# EAGLE design under_construction_v1 (EAGLE 8.7.1)
DATABASE: ./dk_bom.db
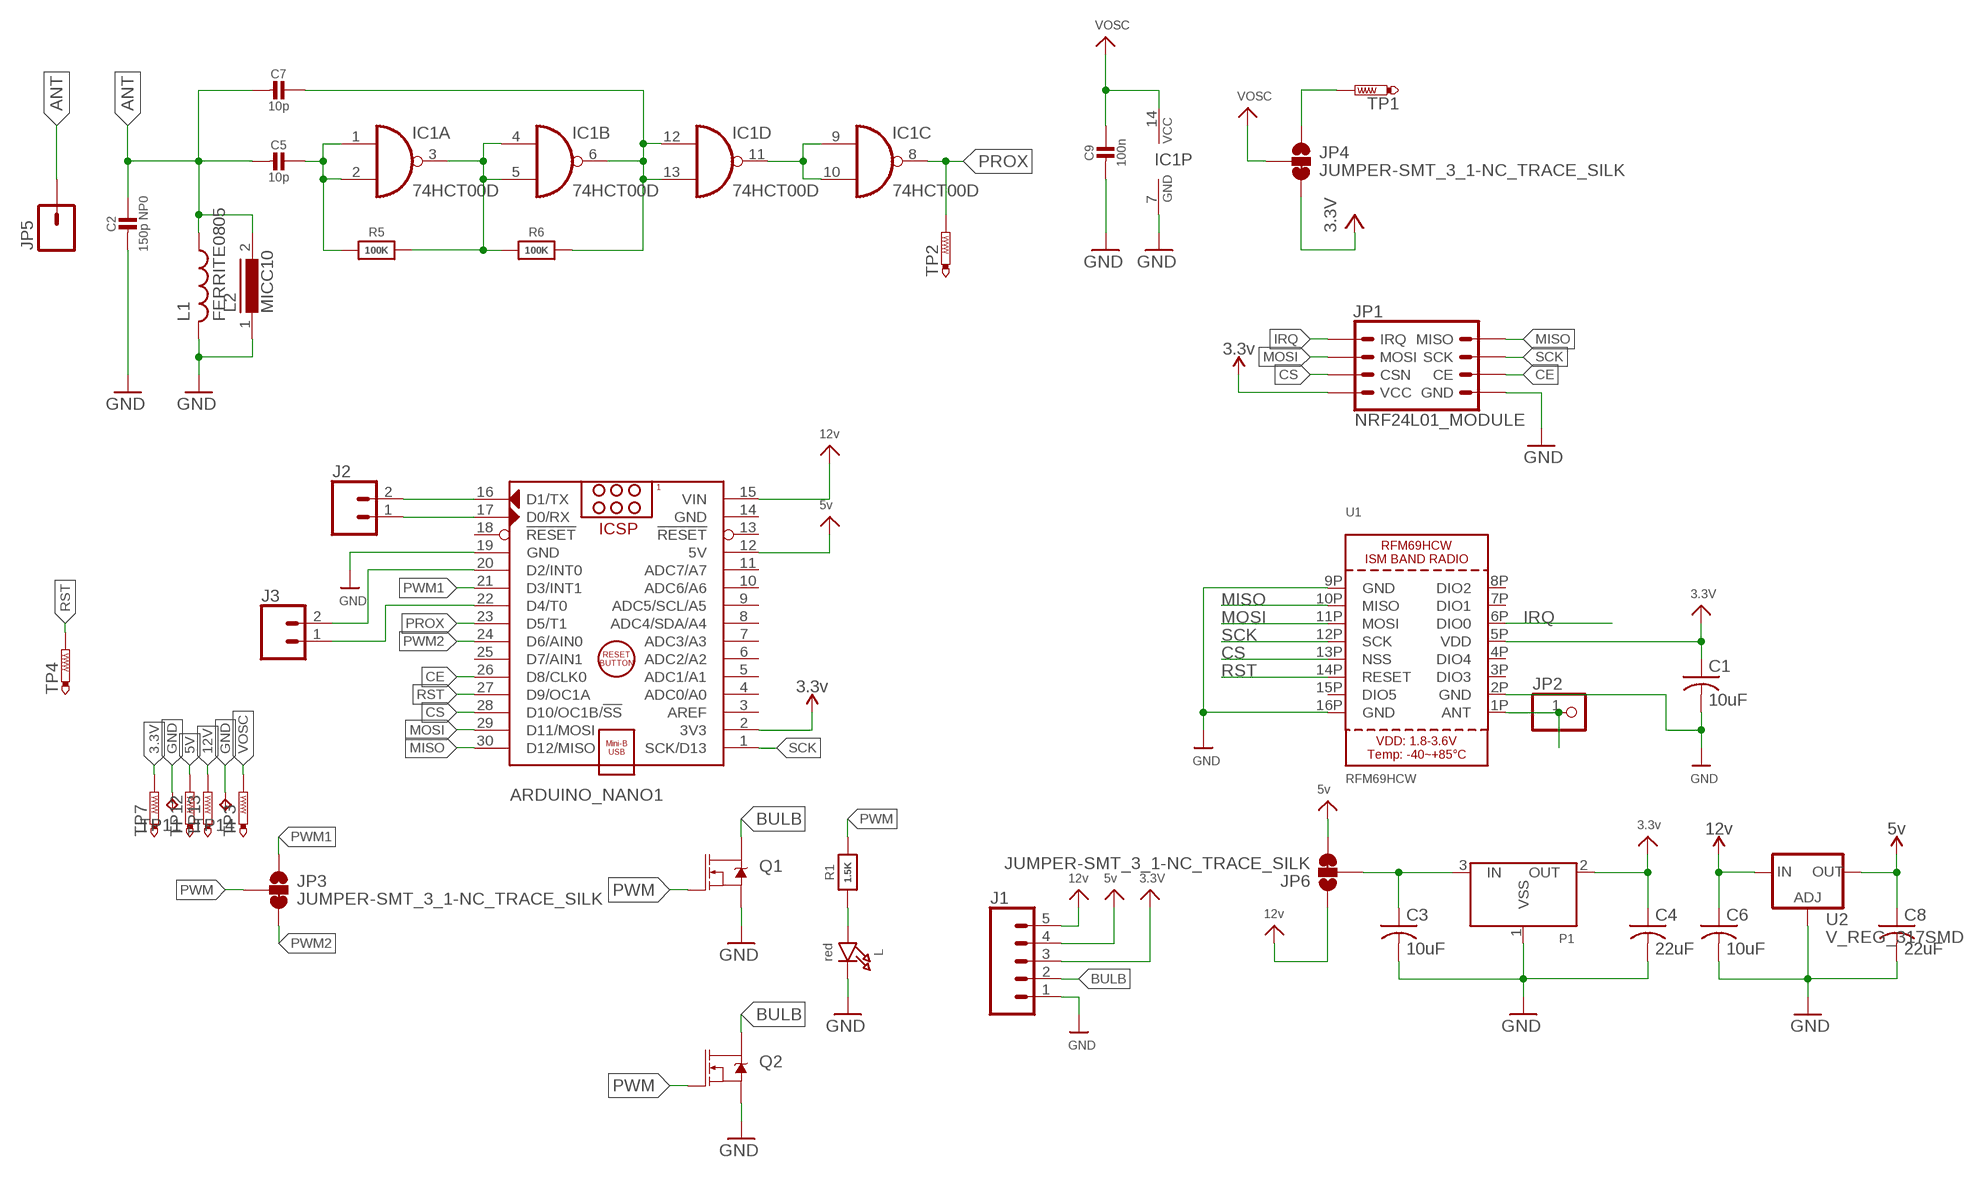
[diagram p0: schematic, sheet 1]

## Parts
ARDUINO_NANO1  ARDUINO_NANO  [ARDUINO_NANO]
C1  10uF  C-USC0805  [C0805]
C2  150p NP0  CAP_CERAMIC0805-NOOUTLINE  [0805-NO]
C3  10uF  C-USC0805  [C0805]
C4  22uF  C-USC0805  [C0805]
C5  10p  CAP_CERAMIC0805-NOOUTLINE  [0805-NO]
C6  10uF  C-USC0805  [C0805]
C7  10p  CAP_CERAMIC0805-NOOUTLINE  [0805-NO]
C8  22uF  C-USC0805  [C0805]
C9  100n  CAP_CERAMIC0805-NOOUTLINE  [0805-NO]
IC1  74HCT00D  [SO14]
J1  CONN_05PTH_LONGPADS  [1X05_LONGPADS]
J2  CONN_02PTH3  [1X02_LONGPADS]
J3  CONN_02PTH3  [1X02_LONGPADS]
JP1  NRF24L01_MODULE  [2X4]
JP2  HEADER-1X1ROUND  [1X01_ROUND]
JP3  JUMPER-SMT_3_1-NC_TRACE_SILK  [SMT-JUMPER_3_1-NC_TRACE_SILK]
JP4  JUMPER-SMT_3_1-NC_TRACE_SILK  [SMT-JUMPER_3_1-NC_TRACE_SILK]
JP5  M01PTH  [1X01]
JP6  JUMPER-SMT_3_1-NC_TRACE_SILK  [SMT-JUMPER_3_1-NC_TRACE_SILK]
L  red  LED0603_NOOUTLINE  [CHIPLED_0603_NOOUTLINE]
L1  FERRITE0805  [0805]
L2  MICC10  [MICC10]
P1  XC6206SOT-89  [SOT-89]
Q1  MOSFET-NCH-FQP30N06L  [TO220V]
Q2  MOSFET-NCH-FQP30N06L  [TO220V]
R1  1.5K  RESISTOR_0603_NOOUT  [0603-NO]
R5  100K  RESISTOR0805_NOOUTLINE  [0805-NO]
R6  100K  RESISTOR0805_NOOUTLINE  [0805-NO]
TP1  VOSC  PTR1TP15R  [TP15R]
TP2  PROX  PTR1TP15R  [TP15R]
TP3  VOSC  PTR1TP15R  [TP15R]
TP4  VOSC  PTR1TP15R  [TP15R]
TP7  VOSC  PTR1TP15R  [TP15R]
TP11  VOSC  TPTP15SQ  [TP15SQ]
TP12  VOSC  PTR1TP15R  [TP15R]
TP13  VOSC  PTR1TP15R  [TP15R]
TP14  VOSC  TPTP15SQ  [TP15SQ]
U1  RFM69HCW  RFM69HCW_SMT  [RFMHCW_SMT]
U2  V_REG_317SMD  [SOT223]

## Nets
3.3V: ARDUINO_NANO1.2(3V3) C1.1 C4.1 J1.3 JP1.7(VCC) JP4.3 P1.2(OUT) TP7.TP U1.5P(VDD) ; supply symbol labelled 3.3v
5V: ARDUINO_NANO1.12(5V) C8.1 J1.4 JP6.3 TP12.TP U2.2(OUT) ; supply symbol labelled 5v
12V: ARDUINO_NANO1.15(VIN) C6.1 J1.5 JP6.1 TP13.TP U2.3(IN) ; supply symbol labelled 12v
ANT: C2.1 C5.2 C7.2 JP5.1 L1.1 L2.2
BULB: J1.2 Q1.2(D) Q2.2(D)
CE: ARDUINO_NANO1.26(D8/CLK0) JP1.6(CE)
CS: ARDUINO_NANO1.28(D10/OC1B/!SS) JP1.5(CSN) U1.13P(NSS)
GND: ARDUINO_NANO1.19(GND) C1.2 C2.2 C3.2 C4.2 C6.2 C8.2 C9.2 IC1.7(P:GND) J1.1 JP1.8(GND) L1.2 L2.1 L.C P1.1(VSS) Q1.3(S) Q2.3(S) TP11.TP TP14.TP U1.2P(GND) U1.9P(GND) U1.16P(GND) U2.1(ADJ)
IRQ: JP1.1(IRQ) U1.6P(DIO0)
MISO: ARDUINO_NANO1.30(D12/MISO) JP1.2(MISO) U1.10P(MISO)
MOSI: ARDUINO_NANO1.29(D11/MOSI) JP1.3(MOSI) U1.11P(MOSI)
N$1: JP2.1 U1.1P(ANT)
N$2: C5.1 IC1.1(A:I0) IC1.2(A:I1) R5.1
N$3: IC1.3(A:O) IC1.4(B:I0) IC1.5(B:I1) R5.2 R6.1
N$4: C7.1 IC1.6(B:O) IC1.12(D:I0) IC1.13(D:I1) R6.2
N$5: C3.1 JP6.2 P1.3(IN)
N$6: ARDUINO_NANO1.17(D0/RX) J2.1
N$7: IC1.9(C:I0) IC1.10(C:I1) IC1.11(D:O)
N$8: ARDUINO_NANO1.16(D1/TX) J2.2
N$9: ARDUINO_NANO1.20(D2/INT0) J3.2
N$10: JP4.1 TP1.TP
N$11: ARDUINO_NANO1.22(D4/T0) J3.1
N$12: L.A R1.1
PROX: ARDUINO_NANO1.23(D5/T1) IC1.8(C:O) TP2.TP
PWM: JP3.2 Q1.1(G) Q2.1(G) R1.2
PWM1: ARDUINO_NANO1.21(D3/INT1) JP3.1
PWM2: ARDUINO_NANO1.24(D6/AIN0) JP3.3
RST: ARDUINO_NANO1.27(D9/OC1A) TP4.TP U1.14P(RESET)
SCK: ARDUINO_NANO1.1(SCK/D13) JP1.4(SCK) U1.12P(SCK)
VOSC: C9.1 IC1.14(P:VCC) JP4.2 TP3.TP
Unconnected: ARDUINO_NANO1.3(AREF) ARDUINO_NANO1.4(ADC0/A0) ARDUINO_NANO1.5(ADC1/A1) ARDUINO_NANO1.6(ADC2/A2) ARDUINO_NANO1.7(ADC3/A3) ARDUINO_NANO1.8(ADC4/SDA/A4) ARDUINO_NANO1.9(ADC5/SCL/A5) ARDUINO_NANO1.10(ADC6/A6) ARDUINO_NANO1.11(ADC7/A7) ARDUINO_NANO1.13(!RESET) ARDUINO_NANO1.18(!RESET) ARDUINO_NANO1.25(D7/AIN1) U1.3P(DIO3) U1.4P(DIO4) U1.7P(DIO1) U1.8P(DIO2) U1.15P(DIO5)

## Power pins joined to a net without a drawn wire
GND: ARDUINO_NANO1.14(GND)

## Library data of the parts
ARDUINO_NANO1 = ArduinoNanoV30:ARDUINO_NANO: Arduino Nano V3.0 Module Overview: The Arduino Nano is a small, complete, and breadboard-friendly board based on the ATmega328 (Arduino Nano 3.x) or ATmega168 (Arduino Nano 2.x). It has more or less the same functionality of the Arduino Duemilanove, but in a different package. It lacks only a DC power jack, and works with a Mini-B USB cable instead of a standard one. The Nano was designed and is being produced by Gravitech <http://www.gravitech.us/arna30wiatp.html>. General specifications: Item Value Microcontroller Atmel ATmega168 or ATmega328 Operating Voltage (logic level) 5 V Input Voltage (recommended) 7-12 V Input Voltage (limits) 6-20 V Digital I/O Pins 14 (of which 6 provide PWM output) Analog Input Pins 8 DC Current per I/O Pin 40 mA Flash Memory 16 KB (ATmega168) or 32 KB (ATmega328) of which 2 KB used by bootloader SRAM 1 KB (ATmega168) or 2 KB (ATmega328) EEPROM 512 bytes (ATmega168) or 1 KB (ATmega328) Clock Speed 16 MHz Dimensions (Inches) 0.73" x 1.70" Dimensions (mm) 18mm x 45mm Overall height About 9 mm (not including pins) Weigth 5 g Power: The Arduino Nano can be powered via the Mini-B USB connection, 6-20V unregulated external power supply (pin 30), or 5V regulated external power supply (pin 27). The power source is automatically selected to the highest voltage source. Memory: The ATmega168 has 16 KB of flash memory for storing code (of which 2 KB is used for the bootloader); the ATmega328 has 32 KB, (also with 2 KB used for the bootloader). The ATmega168 has 1 KB of SRAM and 512 bytes of EEPROM (which can be read and written with the EEPROM library); the ATmega328 has 2 KB of SRAM and 1 KB of EEPROM. Input and Output: Each of the 14 digital pins on the Nano can be used as an input or output, using pinMode(), digitalWrite(), and digitalRead() functions. They operate at 5 volts. Each pin can provide or receive a maximum of 40 mA and has an internal pull-up resistor (disconnected by default) of 20-50 kOhms. In addition, some pins have specialized functions. Visit Arduino - ArduinoBoardNano <https://www.arduino.cc/en/Main/ArduinoBoardNano>
C1 = adafruit:C-US: CAPACITOR, American symbol; PARTNO: EMK212ABJ106MG-T
C2 = microbuilder:CAP_CERAMIC: Ceramic Capacitors For new designs, use the packages preceded by an '_' character since they are more reliable: The following footprints should be used on most boards: _0402 - Standard footprint for regular board layouts _0603 - Standard footprint for regular board layouts _0805 - Standard footprint for regular board layouts _1206 - Standard footprint for regular board layouts For extremely tight-pitch boards where space is at a premium, the following 'micro-pitch' footprints can be used (smaller pads, no silkscreen outline, etc.): _0402MP - Micro-pitch footprint for very dense/compact boards _0603MP - Micro-pitch footprint for very dense/compact boards _0805MP - Micro-pitch footprint for very dense/compact boards _1206MP - Micro-pitch footprint for very dense/compact boards; PARTNO: C0805C151J5GACTU
C3 C6 = adafruit:C-US: CAPACITOR, American symbol; PARTNO: LMK212AB7106MG-T
C4 C8 = adafruit:C-US: CAPACITOR, American symbol; PARTNO: CL21A226MQQNNNE
C5 C7 = microbuilder:CAP_CERAMIC: Ceramic Capacitors For new designs, use the packages preceded by an '_' character since they are more reliable: The following footprints should be used on most boards: _0402 - Standard footprint for regular board layouts _0603 - Standard footprint for regular board layouts _0805 - Standard footprint for regular board layouts _1206 - Standard footprint for regular board layouts For extremely tight-pitch boards where space is at a premium, the following 'micro-pitch' footprints can be used (smaller pads, no silkscreen outline, etc.): _0402MP - Micro-pitch footprint for very dense/compact boards _0603MP - Micro-pitch footprint for very dense/compact boards _0805MP - Micro-pitch footprint for very dense/compact boards _1206MP - Micro-pitch footprint for very dense/compact boards; PARTNO: CL21C100DBANNNC
C9 = microbuilder:CAP_CERAMIC: Ceramic Capacitors For new designs, use the packages preceded by an '_' character since they are more reliable: The following footprints should be used on most boards: _0402 - Standard footprint for regular board layouts _0603 - Standard footprint for regular board layouts _0805 - Standard footprint for regular board layouts _1206 - Standard footprint for regular board layouts For extremely tight-pitch boards where space is at a premium, the following 'micro-pitch' footprints can be used (smaller pads, no silkscreen outline, etc.): _0402MP - Micro-pitch footprint for very dense/compact boards _0603MP - Micro-pitch footprint for very dense/compact boards _0805MP - Micro-pitch footprint for very dense/compact boards _1206MP - Micro-pitch footprint for very dense/compact boards; PARTNO: 885012207072
IC1 = 74xx-eu:74*00: Quad 2-input NAND gate; PARTNO: SN74HC00NSR
J1 = SparkFun-Connectors:CONN_05: Multi connection point. Often used as Generic Header-pin footprint for 0.1 inch spaced/style header connections On any of the 0.1 inch spaced packages, you can populate with these: Break Away Headers - Straight <https://www.sparkfun.com/products/116> (PRT-00116) Break Away Male Headers - Right Angle <https://www.sparkfun.com/products/553> (PRT-00553) Female Headers <https://www.sparkfun.com/products/115> (PRT-00115) Break Away Headers - Machine Pin <https://www.sparkfun.com/products/117> (PRT-00117) Break Away Female Headers - Swiss Machine Pin <https://www.sparkfun.com/products/743> (PRT-00743) For SCREWTERMINALS and SPRING TERMINALS visit here: Screw Terimnals on SparkFun.com <https://www.sparkfun.com/search/results?term=Screw+Terminals> (5mm/3.5mm/2.54mm spacing) This device is also useful as a general connection point to wire up your design to another part of your project. Our various solder wires solder well into these plated through hole pads. Hook-Up Wire - Assortment (Stranded, 22 AWG) <https://www.sparkfun.com/products/11375> (PRT-11375) Hook-Up Wire - Assortment (Solid Core, 22 AWG) <https://www.sparkfun.com/products/11367> (PRT-11367) View the entire wire category on our website here <https://www.sparkfun.com/categories/141> Special notes: Molex polarized connector foot print use with SKU : PRT-08231 with associated crimp pins and housings. 1MM SMD Version SKU: PRT-10208
J2 J3 = SparkFun-Connectors:CONN_02: Multi connection point. Often used as Generic Header-pin footprint for 0.1 inch spaced/style header connections On any of the 0.1 inch spaced packages, you can populate with these: Break Away Headers - Straight <https://www.sparkfun.com/products/116> (PRT-00116) Break Away Male Headers - Right Angle <https://www.sparkfun.com/products/553> (PRT-00553) Female Headers <https://www.sparkfun.com/products/115> (PRT-00115) Break Away Headers - Machine Pin <https://www.sparkfun.com/products/117> (PRT-00117) Break Away Female Headers - Swiss Machine Pin <https://www.sparkfun.com/products/743> (PRT-00743) For SCREWTERMINALS and SPRING TERMINALS visit here: Screw Terimnals on SparkFun.com <https://www.sparkfun.com/search/results?term=Screw+Terminals> (5mm/3.5mm/2.54mm spacing) This device is also useful as a general connection point to wire up your design to another part of your project. Our various solder wires solder well into these plated through hole pads. Hook-Up Wire - Assortment (Stranded, 22 AWG) <https://www.sparkfun.com/products/11375> (PRT-11375) Hook-Up Wire - Assortment (Solid Core, 22 AWG) <https://www.sparkfun.com/products/11367> (PRT-11367) View the entire wire category on our website here <https://www.sparkfun.com/categories/141> Special notes: Molex polarized connector foot print use with: PRT-08233 with associated crimp pins and housings. 2.54_SCREWTERM for use with PRT-10571. 3.5mm Screw Terminal footprints for PRT-08084 5mm Screw Terminal footprints for use with PRT-08432
JP1 = under_construction:NRF24L01_MODULE
JP2 = microbuilder:HEADER-1X1: PIN HEADER
JP3 JP4 JP6 = SparkFun-Jumpers:JUMPER-SMT_3_1-NC_TRACE: Normally closed trace jumper (1 of 2 connections) This jumper has a trace between two pads so it's normally closed (NC). The other connection is normally open (NO). Use a razor knife to open the connection. For best results follow the IPC guidelines for cutting traces: Cutout at least 0.063 mm (0.005 in). Remove all loose material to clean up the cut area. Seal the cut with an approved epoxy. Reapply solder to reclose the connection, or to close the NO connection.
JP5 = RFM69HCW_BOB:M01: Header 1 Standard 1-pin 0.1" header. Use with straight break away headers (SKU : PRT-00116), right angle break away headers (PRT-00553), swiss pins (PRT-00743), machine pins (PRT-00117), and female headers (PRT-00115).
L = microbuilder:LED: LED 0603 - 0603 Surface Mount Package 2mA: Green LED - Low Power (3.9mcd, 2ma, 1.7Vf) - Digikey: 475-2709-2-ND Orange LED - Low Power (9.8mcd, 2ma, 1.8Vf) - Digikey: 475-1194-2-ND Red LED - Low Power (5mcd, 2ma, 1.8Vf) - Digikey: 475-1195-2-ND Yellow LED - Low Power (7mcd, 2ma, 1.8Vf) - Digikey: 475-1196-2-ND 5mA: Blue LED - Low Power (17mcd, 5ma, 2.9Vf) - Digikey: LNJ937W8CRACT-ND 0805 - 0805 Surface Mount Package 2mA: Red LED (8.8mcd, 2mA, 1.8Vf, Clear) - Low Power [Digikey: 475-2510-1-ND] Green LED (5mcd, 2mA, 1.8Vf, Clear) - Low Power [Digikey: 475-2730-1-ND] Yellow LED (11.3mcd, 2mA, 1.8Vf, Clear) - Low Power [Digikey: 475-2555-1-ND] 20mA: Red LED (104mcd, 20mA, Diffused) - LS R976 [Digikey: 475-1278-6-ND] Red LED (12mcd, 20mA, 2.0Vf, Clear) - APT2012EC [Digikey: 754-1128-1-ND] Green LED (15mcd, 20mA, 2.2Vf, Clear) - APT2012GC [Digikey: 754-1131-1-ND] Orange LED (160mcd, 20mA, 2.1Vf, Clear) - APT2012SECK [Digikey: 754-1130-1-ND] 1206 - 1206 Surface Mount Package Green LED (26mcd, 20mA, Diffused) - LG N971 [Digikey: 475-1407-6-ND] Red LED (15mcd, 20mA, Diffused) - LH N974 [Digikey: 475-1416-6-ND] Cree - Cree High-Power Surface Mount LEDs XPEBWT-L1-0000-00D50 - White 111lm 350mA 2.9Vf 6200K 110° XTEAWT-00-0000-00000LEE3 - White 114lm 350mA 2.85Vf 5000K 115° Everlight - Everlight 45-21 Series Surface Mount LEDs 45-21/QK2C-B2832AC2CB2/2T - Warm White 2000mcd 20mA 3.25Vf 3050K 120° 45-21/LK2C-B38452C4CB2/2T - Nuetral White 2000mcd 20mA 3.25Vf 4150K 120° 45-21/LK2C-B50634C6CB2/2T - Cold White 2200mcd 20mA 3.25Vf 5650K 120° PLCC2 Reverse Mount LS T77K-J1L2-1-0-2-R18-Z - Red 11.25mcd 2mA 1.8Vf 630nm 120° LO T77K-L1M2-24-Z - Orange 19.6mcd 2mA 1.8Vf 606nm 120° LY T77K-K2M1-26-Z - Yellow 15.7mcd 2mA 1.8Vf 587nm 120°; PARTNO: 150080SS75000
L1 = Livestream:FERRITE; PARTNO: MLZ2012N100LT000
L2 = inductors:MICC10: INDUCTOR; PARTNO: B78108T1103K000; SPICEPREFIX: L
P1 = Voltage Regulator:XC6206: XC6206P , linear regulator. Producted by TOREX.Co Store Information: EXCEL device corporation http://www.excel-d.com/access/index.html; PARTNO: AZ1117CR-3.3TRG1
Q1 Q2 = SparkFun-DiscreteSemi:MOSFET-NCH: N-channel MOSFETs Voltage controlled devices that allow control of high current outputs. SparkFun Products: SparkFun OpenScale <https://www.sparkfun.com/products/13261> SparkFun Digital Sandbox <https://www.sparkfun.com/products/12651> SparkFun Monster Moto Shield <https://www.sparkfun.com/products/10182> SparkFun MOSFET Power Controller <https://www.sparkfun.com/products/11214>; PARTNO: IRF3708PBF; PROD_ID: TRANS-10060; VALUE: 60V/32A/35mΩ
R1 = microbuilder:RESISTOR: Resistors For new designs, use the packages preceded by an '_' character since they are more reliable: The following footprints should be used on most boards: _0402 - Standard footprint for regular board layouts _0603 - Standard footprint for regular board layouts _0805 - Standard footprint for regular board layouts _1206 - Standard footprint for regular board layouts For extremely tight-pitch boards where space is at a premium, the following 'micro-pitch' footprints can be used (smaller pads, no silkscreen outline, etc.): _0402MP - Micro-pitch footprint for very dense/compact boards _0603MP - Micro-pitch footprint for very dense/compact boards _0805MP - Micro-pitch footprint for very dense/compact boards _1206MP - Micro-pitch footprint for very dense/compact boards; PARTNO: RNCP0603FTD1K50
R5 R6 = microbuilder:RESISTOR: Resistors For new designs, use the packages preceded by an '_' character since they are more reliable: The following footprints should be used on most boards: _0402 - Standard footprint for regular board layouts _0603 - Standard footprint for regular board layouts _0805 - Standard footprint for regular board layouts _1206 - Standard footprint for regular board layouts For extremely tight-pitch boards where space is at a premium, the following 'micro-pitch' footprints can be used (smaller pads, no silkscreen outline, etc.): _0402MP - Micro-pitch footprint for very dense/compact boards _0603MP - Micro-pitch footprint for very dense/compact boards _0805MP - Micro-pitch footprint for very dense/compact boards _1206MP - Micro-pitch footprint for very dense/compact boards; PARTNO: RC2012J104CS
TP1-TP4 TP7 TP12 TP13 = tenna_avr_AD7021_v0_9_shrink:PTR1: TEST PIN .063mm, 25mil circular test point
TP11 TP14 = testpad:TP: Test pad
U1 = microbuilder:RFM69HCW: RFM69HCW - ISM Band RF Transceiver
U2 = SparkFun-IC-Power:V_REG_317: Voltage Regulator Standard LM317 adjustable voltage regulator. AOI (Adjust Output Input). Google 'LM317 Calculator' for easy to use app to get the two resistor values needed. 240/720 for 5V output. 240/390 for 3.3V output. Spark Fun Electronics SKU : COM-00527; PARTNO: AZ1117IH-5.0TRG1

## Board
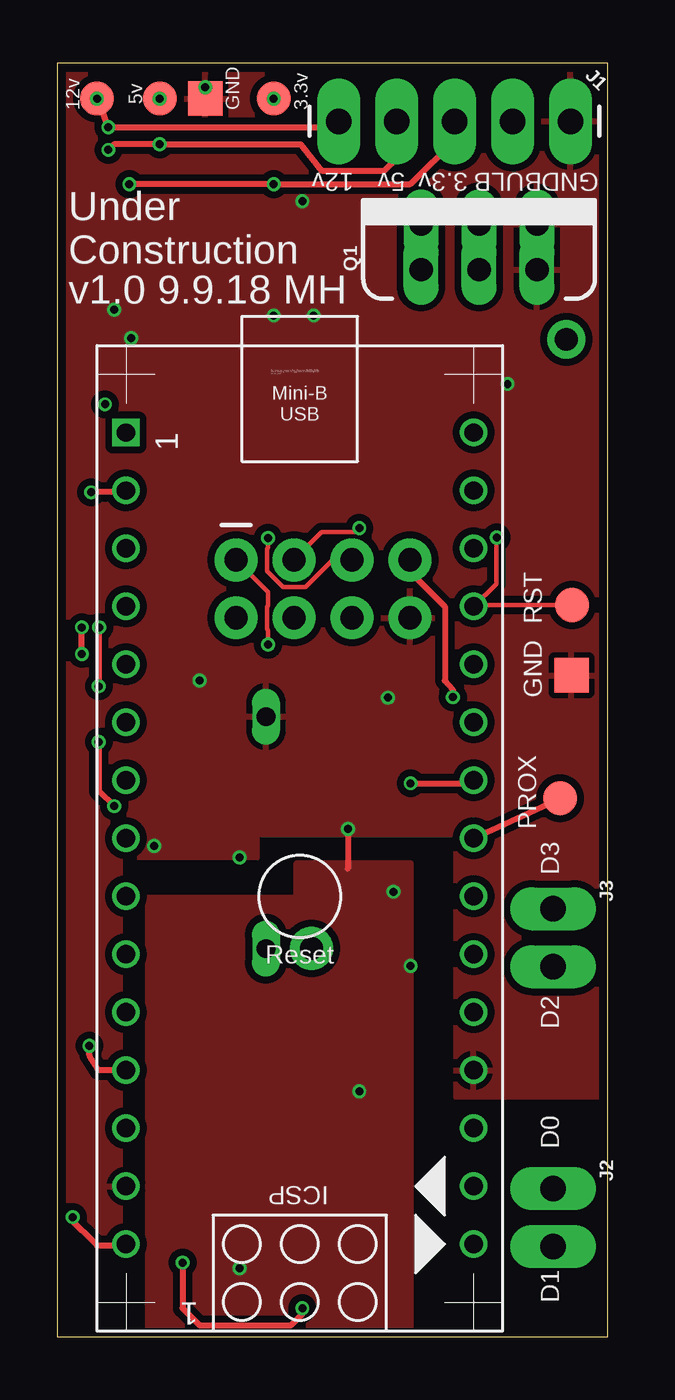
[diagram p1: board, top side]
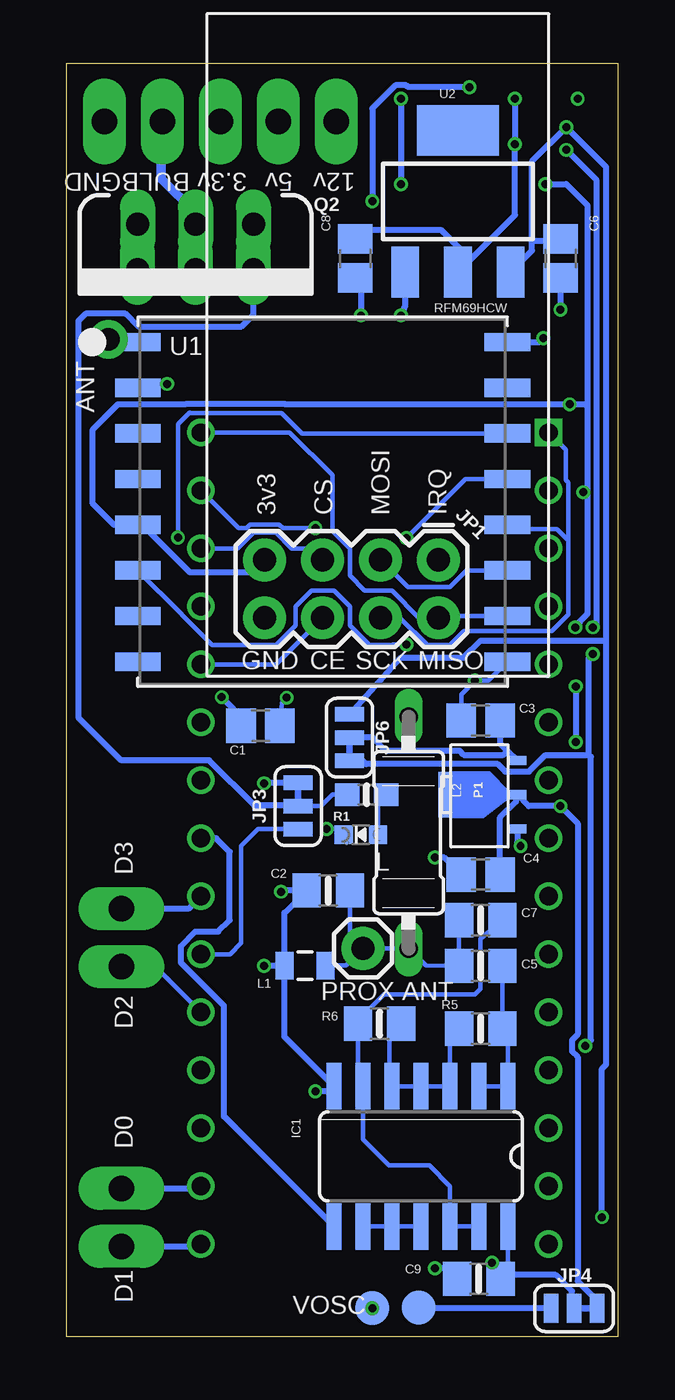
[diagram p2: board, bottom side, seen from below]

Size 24.15 x 55.8 mm. Coordinates in mm from the lower left corner, seen from the top.
Outline: 0,0 24.15,0 24.15,55.8 0,55.8 0,0
Copper layers (1*16): Top 0.035559375mm / dielectric 1.6mm / Bottom 0.035559375mm
Design rules "oshpark_2layer": minimum track width 6mil, minimum drill 10mil, track to track 6mil, track to pad 6mil, pad to pad 6mil, via to via 6mil, smd to smd 6mil, copper to edge 15mil, drill to drill 6mil, minimum pad ring 5mil, minimum via ring 5mil, stop-mask expansion 2.5mil, vias tented up to drill 0mil, thermal gap 10mil

### Footprints (pad centres in the part's own frame; a part is rotated, then mirrored left to right if it is on the bottom)
ARDUINO_NANO = drill 0.8 square: 1 -20.32,-7.62 | drill 0.8: 2 -17.78,-7.62; 3 -15.24,-7.62; 4 -12.7,-7.62; 5 -10.16,-7.62; 6 -7.62,-7.62; 7 -5.08,-7.62; 8 -2.54,-7.62; 9 0,-7.62; 10 2.54,-7.62; 11 5.08,-7.62; 12 7.62,-7.62; 13 10.16,-7.62; 14 12.7,-7.62; 15 15.24,-7.62; 16 15.24,7.62; 17 12.7,7.62; 18 10.16,7.62; 19 7.62,7.62; 20 5.08,7.62; 21 2.54,7.62; 22 0,7.62; 23 -2.54,7.62; 24 -5.08,7.62; 25 -7.62,7.62; 26 -10.16,7.62; 27 -12.7,7.62; 28 -15.24,7.62; 29 -17.78,7.62; 30 -20.32,7.62
C0805 = smd 1.3 x 1.5: 1 -0.85,0; 2 0.85,0
0805-NO = smd 1.24 x 1.5: 1 -0.95,0; 2 0.95,0
SO14 = smd 0.66 x 2.032: 1 -3.81,-3.073; 2 -2.54,-3.073; 3 -1.27,-3.073; 4 0,-3.073; 5 1.27,-3.073; 6 2.54,-3.073; 7 3.81,-3.073; 8 3.81,3.073; 9 2.54,3.073; 10 1.27,3.073; 11 0,3.073; 12 -1.27,3.073; 13 -2.54,3.073; 14 -3.81,3.073
1X05_LONGPADS = drill 1.118 pad 1.88 long: 1 0,0; 2 2.54,0; 3 5.08,0; 4 7.62,0; 5 10.16,0
1X02_LONGPADS = drill 1.118 pad 1.88 long: 1 0,0; 2 2.54,0
2X4 = drill 1.016 pad 1.88: 1 -3.81,-1.27; 2 -3.81,1.27; 3 -1.27,-1.27; 4 -1.27,1.27; 5 1.27,-1.27; 6 1.27,1.27; 7 3.81,-1.27; 8 3.81,1.27
1X01_ROUND = drill 1 pad 1.676: 1 0,0
SMT-JUMPER_3_1-NC_TRACE_SILK = smd 0.635 x 1.27: 1 -1.016,0; 2 0,0; 3 1.016,0
1X01 = drill 1.016 pad 1.88: 1 0,0
CHIPLED_0603_NOOUTLINE = smd 0.8 x 0.8: A 0,-0.75; C 0,0.75
0805 = smd 0.8 x 1.2: 1 -0.9,0; 2 0.9,0
MICC10 = drill 0.813 long: 1 -5.08,0; 2 5.08,0
SOT-89 = smd 0.406 x 0.813: 1 -1.5,-1.6; 2 0,-1.6; 3 1.5,-1.6 | smd 2 x 0.5: P$4 0,1.6
TO220V = drill 1.016 long: 1 -2.54,0; 2 0,0; 3 2.54,0
0603-NO = smd 1.075 x 1: 1 -0.85,0; 2 0.85,0
TP15R = smd 1.5 x 1.5: TP 0,0
TP15SQ = smd 1.5 x 1.5: TP 0,0
RFMHCW_SMT = smd 2 x 0.8: 1P 8.1,-7; 2P 8.1,-5; 3P 8.1,-3; 4P 8.1,-1; 5P 8.1,1; 6P 8.1,3; 7P 8.1,5; 8P 8.1,7; 9P -8.1,7; 10P -8.1,5; 11P -8.1,3; 12P -8.1,1; 13P -8.1,-1; 14P -8.1,-3; 15P -8.1,-5; 16P -8.1,-7
SOT223 = smd 1.219 x 2.235: 1 -2.311,-3.099; 2 0,-3.099; 3 2.311,-3.099 | smd 3.6 x 2.2: 4 0,3.099

### Placement (x,y rotation side)
ARDUINO_NANO1  10.64,19.3 270 top
C1  15.65,26.77 0 bottom
C2  12.68,19.55 180 bottom
C3  6,27 180 bottom
C4  6,20.25 180 bottom
C5  6,16.25 180 bottom
C6  2.5,47.25 270 bottom
C7  6,18.25 180 bottom
C8  11.5,47.25 270 bottom
C9  6.08,2.54 180 bottom
IC1  8.62,7.9 180 bottom
J1  22.5,53.25 180 top
J2  21.75,6.5 270 top
J3  21.75,18.75 270 top
JP1  11.66,32.77 180 bottom
JP2  22.32,43.7 0 top
JP3  14,23.25 90 bottom
JP4  1.91,1.24 0 bottom
JP5  11.16,17.01 270 bottom
JP6  11.75,26.25 270 bottom
L  11.25,22 90 bottom
L1  13.7,16.26 180 bottom
L2  9.16,22.09 270 bottom
P1  6,23.75 90 bottom
Q1  18.5,46.75 0 top
Q2  18.5,48.75 180 bottom
R1  11,23.75 180 bottom
R5  6,13.5 180 bottom
R6  10.43,13.72 180 bottom
TP1  8.72,1.29 270 bottom
TP2  22.05,23.59 0 top
TP3  10.75,1.25 0 bottom
TP4  22.57,32.06 90 top
TP7  9.5,54.25 0 top
TP11  22.55,28.98 0 top
TP12  4.5,54.25 0 top
TP13  1.75,54.25 0 top
TP14  6.5,54.25 0 top
U1  12.93,36.58 180 bottom
U2  7,49.75 0 bottom

### Tracks (layer width: path | path; a pad name or v marks a point on that pad's centre or on a via)
3.3V  (via drill 0.35)
  Top 0.203: ARDUINO_NANO1.2 2.94,37
  Top 0.254: J1.3 17.42,52.58 17.5,52.5 15.5,50.5 v9.5,50.5 v3.17,50.5 | JP1.7 15.47,33.53 17,32 17,28.75 17.35,28.35 v17.35,28.02 | v1.85,31.08 1.83,31.07 v1.83,28.5 | v1.83,26.07 1.83,23.92 v2.5,23.25 | 2.94,37 v1.5,37
  Bottom 0.203: v1.5,37 1.32,37
  Bottom 0.254: C4.1 5.15,22.74 4.44,23.45 4.44,23.71 P1.2 3.9,23.25 v2.5,23.25 1.75,22.5 1.75,13.24 2,12.99 2,12.51 1.75,12.26 1.75,2.44 0.92,1.6 0.92,1.27 JP4.3 0.92,1.24 0.92,1.65 1,1.65 | JP1.7 16.01,33.5 18.75,33.5 20.83,35.58 U1.5P 22.08,35.58 23,36.5 23,39.75 21.9,40.85 18.93,40.85 18.91,40.88 14.59,40.88 14.56,40.85 v2.1,40.85 | 2.35,40.85 v2.1,40.85 | TP7.TP v9.5,50.5 | v3.17,50.5 2.25,50.5 1.32,49.57 1.32,40.75 | v2.1,40.85 1.42,40.85 1.32,40.75 | v1.85,31.08 1.67,31.26 1.67,31.32 1.32,31.67 1.32,37 1.32,40.75 | v1.83,28.5 v1.83,26.07 | C1.1 16.85,27.52 v17.35,28.02
  other vias: 9.5,54.25
5V  (via drill 0.35)
  Top 0.254: ARDUINO_NANO1.12 1.82,11.68 1.42,12.33 v1.42,12.75 | J1.4 14.88,51.87 15,51.75 14.34,51.09 11.59,51.09 10.68,52.25 v4.5,52.25 2.5,52.25 v2.25,52 | v1.09,29.92 v1.09,31.08
  Bottom 0.254: TP12.TP v4.5,52.25 4.5,49.15 6.7,46.95 | U2.2 6.7,46.95 | C8.1 11.4,48.1 11,48.5 7.75,48.5 6.7,47.45 6.7,46.95 | JP6.3 11.17,25.23 11.03,25.09 5.25,25.09 4.92,24.77 3.88,24.77 3.16,25.48 1.25,25.48 | 1.25,25.48 1.17,25.4 1.17,13 v1.42,12.75 | 1.25,25.48 1.25,29.76 v1.09,29.92 | v1.09,31.08 0.91,31.26 0.91,50.66 v2.25,52
  other vias: 4.5,54.25
12V  (via drill 0.35)
  Top 0.254: ARDUINO_NANO1.15 2.71,4 1.75,4 0.51,5.24 v0.68,5.24 | TP13.TP 2,53.7 v2.25,53 12.25,53 J1.5
  Bottom 0.254: U2.3 3.75,47.59 3.75,48 | 3.75,48 3.75,51.5 v2.25,53 0.51,51.26 0.51,30.5 | C6.1 2.6,48 3.75,48 | JP6.1 9.52,29.75 6.75,29.75 6,30.5 0.51,30.5 | v0.68,5.24 0.68,11.74 0.51,11.92 0.51,30.5
  other vias: 1.75,54.25
ANT
  Bottom 0.203: C7.2 C5.2 8.41,16.26 L2.2 JP5.1 11.21,16.96 | L1.1 11.91,16.26 11.21,16.96 | C2.1 11.73,17.48 11.21,16.96
BULB
  Bottom 0.254: Q2.2 Q1.2
  Bottom 0.406: Q1.2 18.5,49.25 20,50.75 20,53.21 J1.2
CE
  Bottom 0.203: ARDUINO_NANO1.26 14.97,29.46 JP1.6
CS  (via drill 0.35)
  Top 0.203: JP1.5 12.08,34.04 10.88,32.85 9.9,32.85 9.2,33.55 9.2,34.53 9.25,34.59 v9.25,35
  Bottom 0.203: JP1.5 13.43,34.54 14.28,34.54 14.98,35.23 15.96,35.23 16.66,34.54 ARDUINO_NANO1.28 | v9.25,35 6.67,37.58 U1.13P
GND  (via drill 0.35)
  Top 0.254: v12.75,22.25 12.75,20.5 | TP14.TP v6.5,54.75
  Bottom 0.203: L.C 12.25,22.25 v12.75,22.25 | U1.9P 5.66,28.75 v6.25,28.75 6.85,28.15 C3.2 | C1.2 14.7,27.8 v14.5,28
  Bottom 0.254: C9.2 7.49,3 v8,3 | L1.2 14.6,13.15 IC1.7 12.66,10.75 v13.25,10.75 | L1.2 14.6,18.58 C2.2 14.7,19.55 v14.75,19.5 | L1.2 v15.5,16.25 | C4.2 7.6,21 v8,21 | P1.1 4.4,21.65 v4.25,21.5 | U1.16P 3.42,43.58 v3.25,43.75 | C6.2 v2.5,45 | U2.1 9.31,45.19 v9.5,44.75 | C8.2 11.25,46.15 v11.25,44.75 | v6.5,54.75 9.18,54.75 9.26,54.83 9.74,54.83 10.75,53.82 v10.75,49.75 | U1.2P 20.86,41.75 v19.75,41.75
  pour Top (isolate 0.305): 0.25,55.5 23.75,55.5 23.75,10.5 17.5,10.5 17.5,22 8.75,22 8.75,21 2.75,21 2.75,0.5 3,0.25 0.25,0.25
  pour Top (isolate 0.305): 15.5,0.25 4,0.25 4,19.25 10.5,19.25 10.5,20.75 15.5,20.75
IRQ  (via drill 0.35)
  Top 0.203: JP1.1 9.25,32.64 9.25,32.05 9.2,31.99 9.2,31.01 9.25,30.95 v9.25,30.33 9.25,30.25
  Bottom 0.203: v9.25,30.33 9.87,30.33 9.9,30.31 10.88,30.31 11.74,31.16 11.74,31.99 12.44,32.69 13.42,32.69 14.12,31.99 14.12,31.16 14.98,30.31 17.77,30.31 19.11,31.65 19.11,31.66 U1.6P
MISO
  Bottom 0.203: U1.10P 7.77,31.58 JP1.2 8.7,31.5 9.9,32.69 11.08,32.69 11.74,33.35 11.74,34.53 12.5,35.3 12.5,37.75 14.37,39.62 ARDUINO_NANO1.30
MOSI  (via drill 0.35)
  Top 0.203: JP1.3 11.6,35.25 13.25,35.25 v13.25,35.43
  Bottom 0.203: U1.11P 6.62,33.58 7.36,32.85 9.2,32.85 JP1.3 | ARDUINO_NANO1.29 16.61,35.43 16.27,35.43 16.11,35.59 14.83,35.59 14.67,35.43 v13.25,35.43
N$1
  Bottom 0.254: U1.1P 22.2,43.58 JP2.1
N$2
  Bottom 0.203: IC1.2 IC1.1 4.81,13.4 R5.1 C5.1
N$3
  Bottom 0.203: R5.2 7.35,13.4 IC1.3 IC1.4 IC1.5 10,11.09 10,13.2 R6.1
N$4
  Bottom 0.203: IC1.13 IC1.12 7.35,6.6 8.25,7.5 10.02,7.5 11.16,8.64 11.16,10.75 | 11.16,10.75 IC1.6 11,11.14 | C7.1 6,17.43 6,15.25 6.25,15 10.25,15 11.38,13.87 R6.2 11.38,10.97 11.16,10.75
N$5
  Bottom 0.254: C3.1 5.15,26 4.83,25.68 | 4.83,25.68 P1.3 | 4.83,25.68 5,25.5 6.75,25.5 6.92,25.67 10.17,25.67 10.75,26.25 JP6.2
N$6
  Bottom 0.254: J2.1 18.36,6.5 ARDUINO_NANO1.17
N$7
  Bottom 0.203: IC1.11 IC1.10 IC1.9
N$8
  Bottom 0.254: J2.2 18.36,3.96 ARDUINO_NANO1.16
N$9
  Bottom 0.203: ARDUINO_NANO1.20 20.25,16.21 J3.2
N$10
  Bottom 0.254: JP4.1 8.67,1.24 TP1.TP
N$11
  Bottom 0.254: ARDUINO_NANO1.22 18.81,18.75 J3.1
N$12
  Bottom 0.203: R1.1 10.5,23.4 L.A
PROX
  Top 0.254: TP2.TP ARDUINO_NANO1.23
  Bottom 0.254: IC1.8 17.25,9.65 17.25,14.5 19.14,16.39 19.14,17.12 18.51,17.75 17.5,17.75 17,18.25 17,21.25 17.59,21.84 ARDUINO_NANO1.23
PWM
  Bottom 0.203: JP3.2 13,23.25 12.5,23.75 R1.2
  Bottom 0.254: JP3.2 14.03,23.27 15.91,23.27 17.9,25.26 18.62,25.26 18.63,25.25 21.75,25.25 23.64,27.14 23.64,44.5 23.32,44.82 21.57,44.82 21.01,44.26 16.49,44.26 15.96,44.79 Q1.1 Q2.1
PWM1
  Bottom 0.203: 17.74,16.76 16.99,16.76 16.5,17.25 16.5,21.5 15.75,22.25 14.02,22.25 JP3.1
  Bottom 0.254: ARDUINO_NANO1.21 17.74,16.76
PWM2  (via drill 0.35)
  Top 0.254: v15.5,24.25 18.13,24.25 ARDUINO_NANO1.24
  Bottom 0.254: JP3.3 15.48,24.27 v15.5,24.25
RST  (via drill 0.35)
  Top 0.203: v19.27,35.02 19.25,35 19.25,32.99 ARDUINO_NANO1.27 18.32,32.06 TP4.TP
  Bottom 0.203: v19.27,35.02 19.27,39.98 18.75,40.5 18.72,40.47 14.72,40.47 13.83,39.58 U1.14P
SCK
  Bottom 0.203: 4.91,35.5 U1.12P 4.64,35.39 2.67,35.39 2.17,34.89 | JP1.4 9.54,31.5 8.34,30.31 7.36,30.31 6.74,30.93 2.89,30.93 2.17,31.65 2.17,34.75 2.17,34.89 | ARDUINO_NANO1.1 2.26,38.86 2.26,37.53 2.17,37.43 2.17,34.89
VOSC  (via drill 0.35)
  Top 0.254: v5.5,3.25 5.5,1.25 6.24,0.51 10.26,0.51 10.75,1 TP3.TP
  Bottom 0.203: IC1.14 4.81,2.86 4.96,2.71 C9.1
  Bottom 0.254: JP4.2 2,1.34 2,2 2.71,2.71 4.96,2.71 | C9.1 5.13,2.88 v5.5,3.25
  other vias: 10.75,1.25

### Text on the board
tPlace: 12v | 5v | GND | 3.3v | 12v | 5v | 3.3v | BULB | GND | Under / Construction | v1.0 9.9.18 MH | RST | GND | PROX | D3 | D2 | D0 | D1
bPlace: 12v | 5v | 3.3v | BULB | GND | ANT | IRQ | MOSI | CS | 3v3 | MISO | SCK | CE | GND | D3 | PROX ANT | D2 | D0 | D1 | VOSC